# Altium project МЦТР.00010528.00.001.PrjPcb
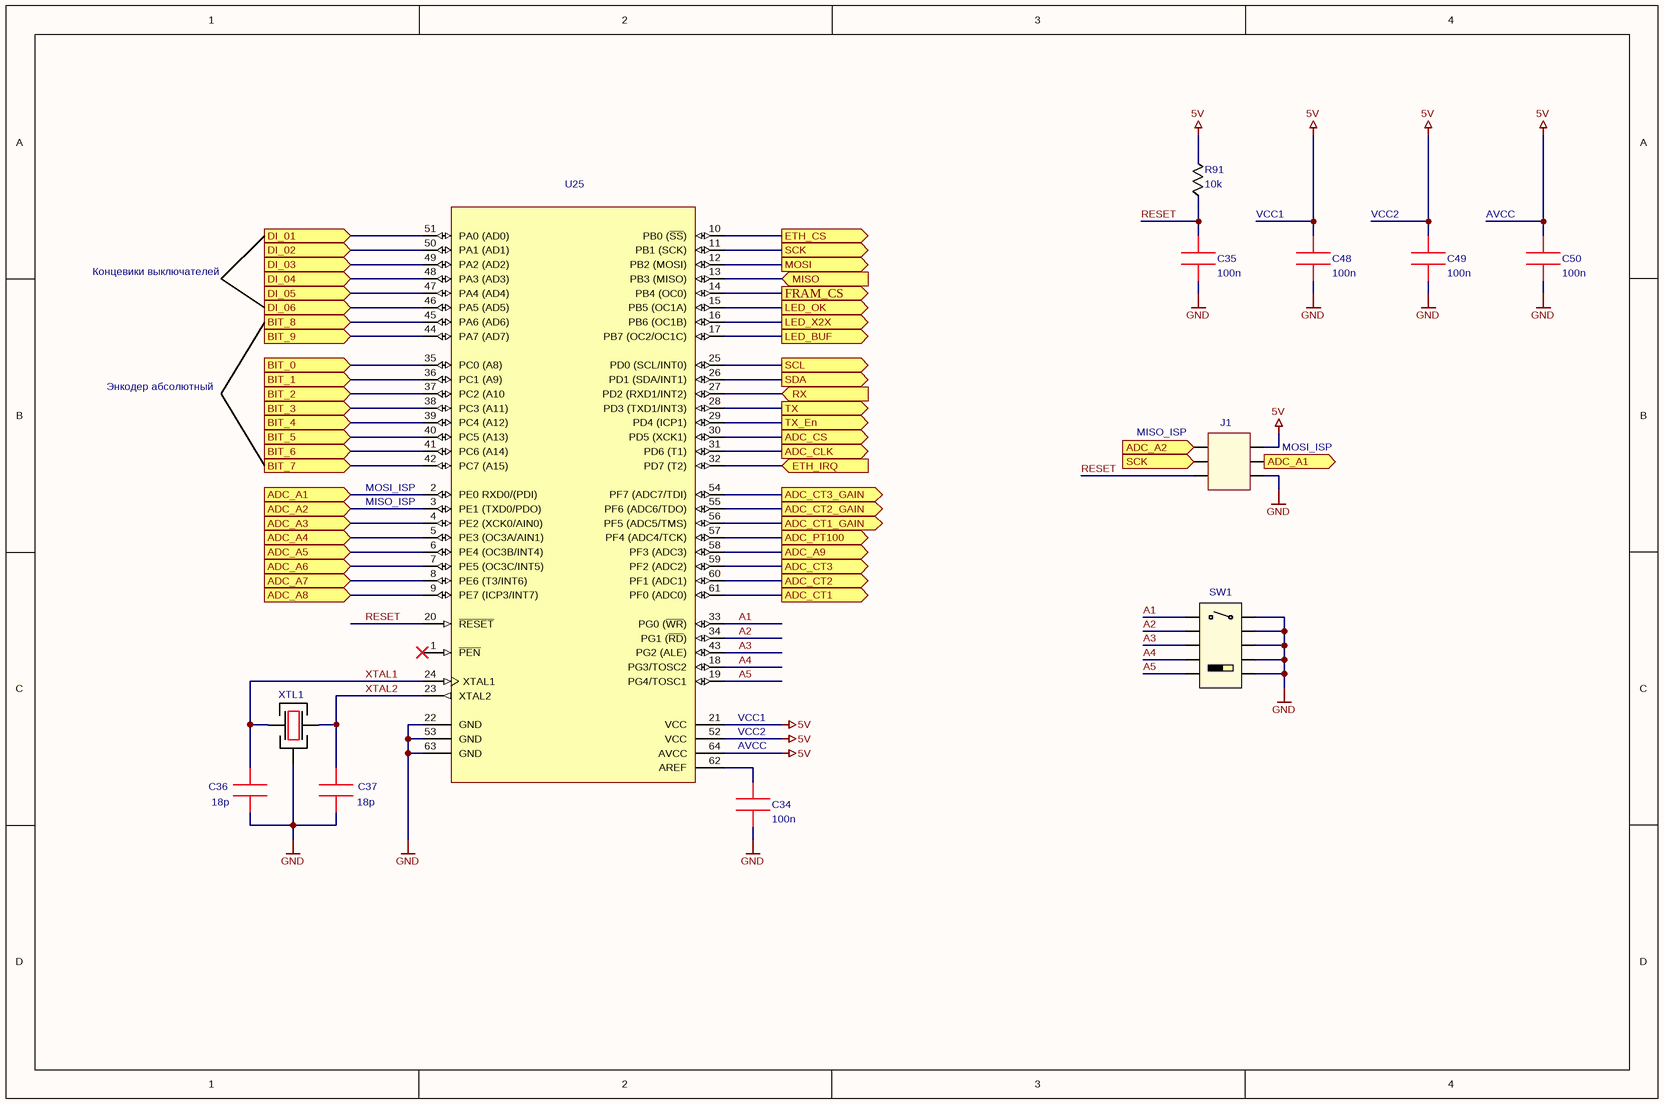
[diagram p0: MCU.SchDoc]
6 sheets, 163 parts. Net scope: global (net labels, ports and power ports of the same name join across sheets).
Board file: 讨倚.00010528.00.001.PcbDoc
Sheets:
  MCU.SchDoc
  RTC.SchDoc
  CT Main.SchDoc
  DI 220V DC.SchDoc
  PT100.SchDoc
  LEDs.SchDoc

## Sheet MCU.SchDoc
size A4

### Parts
C34  100n  [0603]
C35  100n  [0603]
C36  18p  [0603]
C37  18p  [0603]
C48  100n  [0603]
C49  100n  [0603]
C50  100n  [0603]
J1  Pin Line 2x3  [PLD-6 2.54]  (value not drawn)
R91  10k  [0603]
SW1  DIP-Switch 5 Pins  [Switch DIP-5]  (value not drawn)
U25  MCU  [64A_N]  (value not drawn)
XTL1  16.0 MHz  [ABM10]  (value not drawn)

### Ports
ADC_A1, ADC_A2, ADC_A3, ADC_A4, ADC_A5, ADC_A6, ADC_A7, ADC_A8, ADC_A9, ADC_CLK, ADC_CS, ADC_CT1, ADC_CT1_GAIN, ADC_CT2, ADC_CT2_GAIN, ADC_CT3, ADC_CT3_GAIN, ADC_PT100, BIT_0, BIT_1, BIT_2, BIT_3, BIT_4, BIT_5, BIT_6, BIT_7, BIT_8, BIT_9, DI_01, DI_02, DI_03, DI_04, DI_05, DI_06, ETH_CS, ETH_IRQ, FRAM_CS, LED_BUF, LED_OK, LED_X2X, MISO, MOSI, RX, SCK, SCL, SDA, TX, TX_En

### Nets
5V: C48.2 C49.2 C50.2 J1.2 R91.2 U25.21(VCC) U25.52(VCC) U25.64(AVCC)
GND: C34.1 C35.1 C36.1 C37.1 C48.1 C49.1 C50.1 J1.6 SW1.1 SW1.3 SW1.5 SW1.7 SW1.9 U25.22(GND) U25.53(GND) U25.63(GND) XTL1.2
A1: SW1.2 U25.33(PG0_(~{WR}))
A2: SW1.4 U25.34(PG1_(~{RD}))
A3: SW1.6 U25.43(PG2_(ALE))
A4: SW1.8 U25.18(PG3/TOSC2)
A5: SW1.10 U25.19(PG4/TOSC1)
ADC_A1: J1.4 U25.2(PE0_RXD0/(PDI)) ; port ADC_A1
ADC_A2: J1.1 U25.3(PE1_(TXD0/PDO)) ; port ADC_A2
ADC_A3: U25.4(PE2_(XCK0/AIN0)) ; port ADC_A3
ADC_A4: U25.5(PE3_(OC3A/AIN1)) ; port ADC_A4
ADC_A5: U25.6(PE4_(OC3B/INT4)) ; port ADC_A5
ADC_A6: U25.7(PE5_(OC3C/INT5)) ; port ADC_A6
ADC_A7: U25.8(PE6_(T3/INT6)) ; port ADC_A7
ADC_A8: U25.9(PE7_(ICP3/INT7)) ; port ADC_A8
ADC_A9: U25.58(PF3_(ADC3)) ; port ADC_A9
ADC_CLK: U25.31(PD6_(T1)) ; port ADC_CLK
ADC_CS: U25.30(PD5_(XCK1)) ; port ADC_CS
ADC_CT1: U25.61(PF0_(ADC0)) ; port ADC_CT1
ADC_CT1_GAIN: U25.56(PF5_(ADC5/TMS)) ; port ADC_CT1_GAIN
ADC_CT2: U25.60(PF1_(ADC1)) ; port ADC_CT2
ADC_CT2_GAIN: U25.55(PF6_(ADC6/TDO)) ; port ADC_CT2_GAIN
ADC_CT3: U25.59(PF2_(ADC2)) ; port ADC_CT3
ADC_CT3_GAIN: U25.54(PF7_(ADC7/TDI)) ; port ADC_CT3_GAIN
ADC_PT100: U25.57(PF4_(ADC4/TCK)) ; port ADC_PT100
BIT_0: U25.35(PC0_(A8)) ; port BIT_0
BIT_1: U25.36(PC1_(A9)) ; port BIT_1
BIT_2: U25.37(PC2_(A10) ; port BIT_2
BIT_3: U25.38(PC3_(A11)) ; port BIT_3
BIT_4: U25.39(PC4_(A12)) ; port BIT_4
BIT_5: U25.40(PC5_(A13)) ; port BIT_5
BIT_6: U25.41(PC6_(A14)) ; port BIT_6
BIT_7: U25.42(PC7_(A15)) ; port BIT_7
BIT_8: U25.45(PA6_(AD6)) ; port BIT_8
BIT_9: U25.44(PA7_(AD7)) ; port BIT_9
DI_01: U25.51(PA0_(AD0)) ; port DI_01
DI_02: U25.50(PA1_(AD1)) ; port DI_02
DI_03: U25.49(PA2_(AD2)) ; port DI_03
DI_04: U25.48(PA3_(AD3)) ; port DI_04
DI_05: U25.47(PA4_(AD4)) ; port DI_05
DI_06: U25.46(PA5_(AD5)) ; port DI_06
ETH_CS: U25.10(PB0_(~{SS})) ; port ETH_CS
ETH_IRQ: U25.32(PD7_(T2)) ; port ETH_IRQ
FRAM_CS: U25.14(PB4_(OC0)) ; port FRAM_CS
LED_BUF: U25.17(PB7_(OC2/OC1C)) ; port LED_BUF
LED_OK: U25.15(PB5_(OC1A)) ; port LED_OK
LED_X2X: U25.16(PB6_(OC1B)) ; port LED_X2X
MISO: U25.13(PB3_(MISO)) ; port MISO
MOSI: U25.12(PB2_(MOSI)) ; port MOSI
RESET: C35.2 J1.5 R91.1 U25.20(~{RESET})
RX: U25.27(PD2_(RXD1/INT2)) ; port RX
SCK: J1.3 U25.11(PB1_(SCK)) ; port SCK
SCL: U25.25(PD0_(SCL/INT0)) ; port SCL
SDA: U25.26(PD1_(SDA/INT1)) ; port SDA
TX: U25.28(PD3_(TXD1/INT3)) ; port TX
TX_En: U25.29(PD4_(ICP1)) ; port TX_En
XTAL1: C36.2 U25.24(XTAL1) XTL1.1
XTAL2: C37.2 U25.23(XTAL2) XTL1.3
NetC34_2: C34.2 U25.62(AREF)

Not connected (* = marked no-connect by the designer): U25 1(~{PEN})*

### Notes on the sheet
- VCC1
- VCC2
- AVCC
- Концевики выключателей
- Энкодер абсолютный
- (near J1) MISO_ISP
- (near J1) MOSI_ISP
- (near U25) MOSI_ISP
- (near U25) MISO_ISP
- (near U25) VCC1

### Library data of the parts
C34 C35 C48-C50 = 0603 CAP: CC0603KRX7R9BB104
C36 C37 = 0603 CAP: CC0603JRNPO9BN180
J1 = PLD-6
R91 = 0603 RES: RC0603FR-0710KL
SW1 = Switch DIP-5: DIP-Switch NDP-05
U25 = ATmega128A-AU: DatasheetVersion: revH, Feb-2011; PackageVersion: revC, Oct-2010; PackageReference: 64A; PackageDescription: 64-Pin Plastic Thin Profile Quad Flat Pack, 14 x 14 x 1.0 mm Body, 0.8 mm Pitch (TQFP); Code_JEDEC: MS-026-AEB; ComponentLink1Description: Manufacturer URL; ComponentLink1URL: http://www.atmel.com/; ComponentLink2Description: ATmega128A Datasheet; ComponentLink2URL: http://www.atmel.com/dyn/resources/prod_documents/doc8151.pdf; ComponentLink3Description: ATmega128A Summary; ComponentLink3URL: http://www.atmel.com/dyn/resources/prod_documents/8151S.pdf
XTL1 = KX-7: 12.88605

## Sheet RTC.SchDoc
size A4; PageSetup: Record=PageOptions|CenterHorizontal=True|CenterVertical=True|PrintScale=0.99|XCorrection=1.00|YCorrection=1.00|PrintKind=1|BorderSize=5000000|LeftOffset=0|BottomOffset=0|Orientation=1|PaperLength=1000|PaperWidth=1000|Scale=100|PaperSource=15|PrintQuality=600|MediaType=1|DitherType=10|PrintScaleMode=1|PaperKind=A4|PaperIndex=9
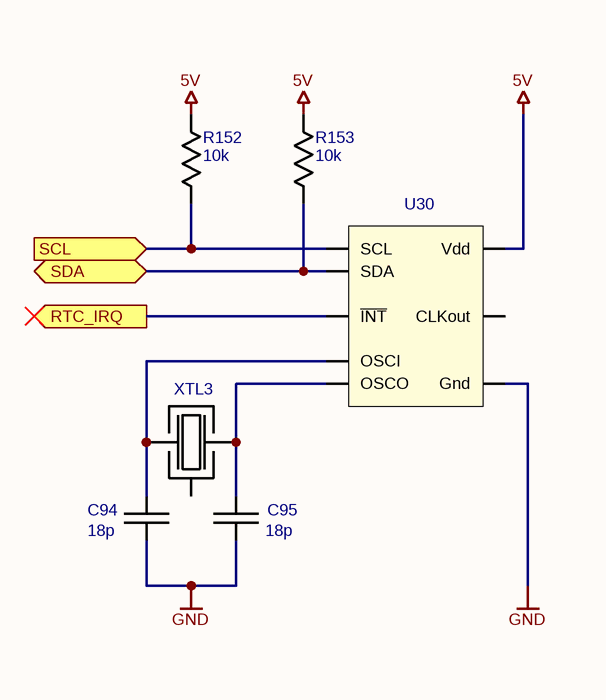
[diagram p1: RTC.SchDoc]

### Parts
C94  18p  [CAP CER 0603 NP]
C95  18p  [CAP CER 0603 NP]
R152  10k  [RES 0603]
R153  10k  [RES 0603]
U30  Real-Time Clock IC  [SOIC-8]  (value not drawn)
XTL3  32.768 kHz  [XTAL KX-327NHT]  (value not drawn)

### Ports
RTC_IRQ, SCL, SDA

### Nets
5V: R152.2 R153.2 U30.8(Vdd)
GND: C94.1 C95.1 U30.4(Gnd)
RTC_IRQ: U30.3(~{INT}) ; port RTC_IRQ
SCL: R152.1 U30.6(SCL) ; port SCL
SDA: R153.1 U30.5(SDA) ; port SDA
NetC94_2: C94.2 U30.1(OSCI) XTL3.1
NetC95_2: C95.2 U30.2(OSCO) XTL3.3

Not connected (* = marked no-connect by the designer): U30 7(CLKout); XTL3 2

### Library data of the parts
C94 C95 = Capacitor: CC0603JRNPO9BN180
R152 R153 = Resistor: RC0603FR-0710KL
U30 = PCF8653: PCF8563T/5,518
XTL3 = Quartz Resonator: 12.87150

## Sheet CT Main.SchDoc
size A3
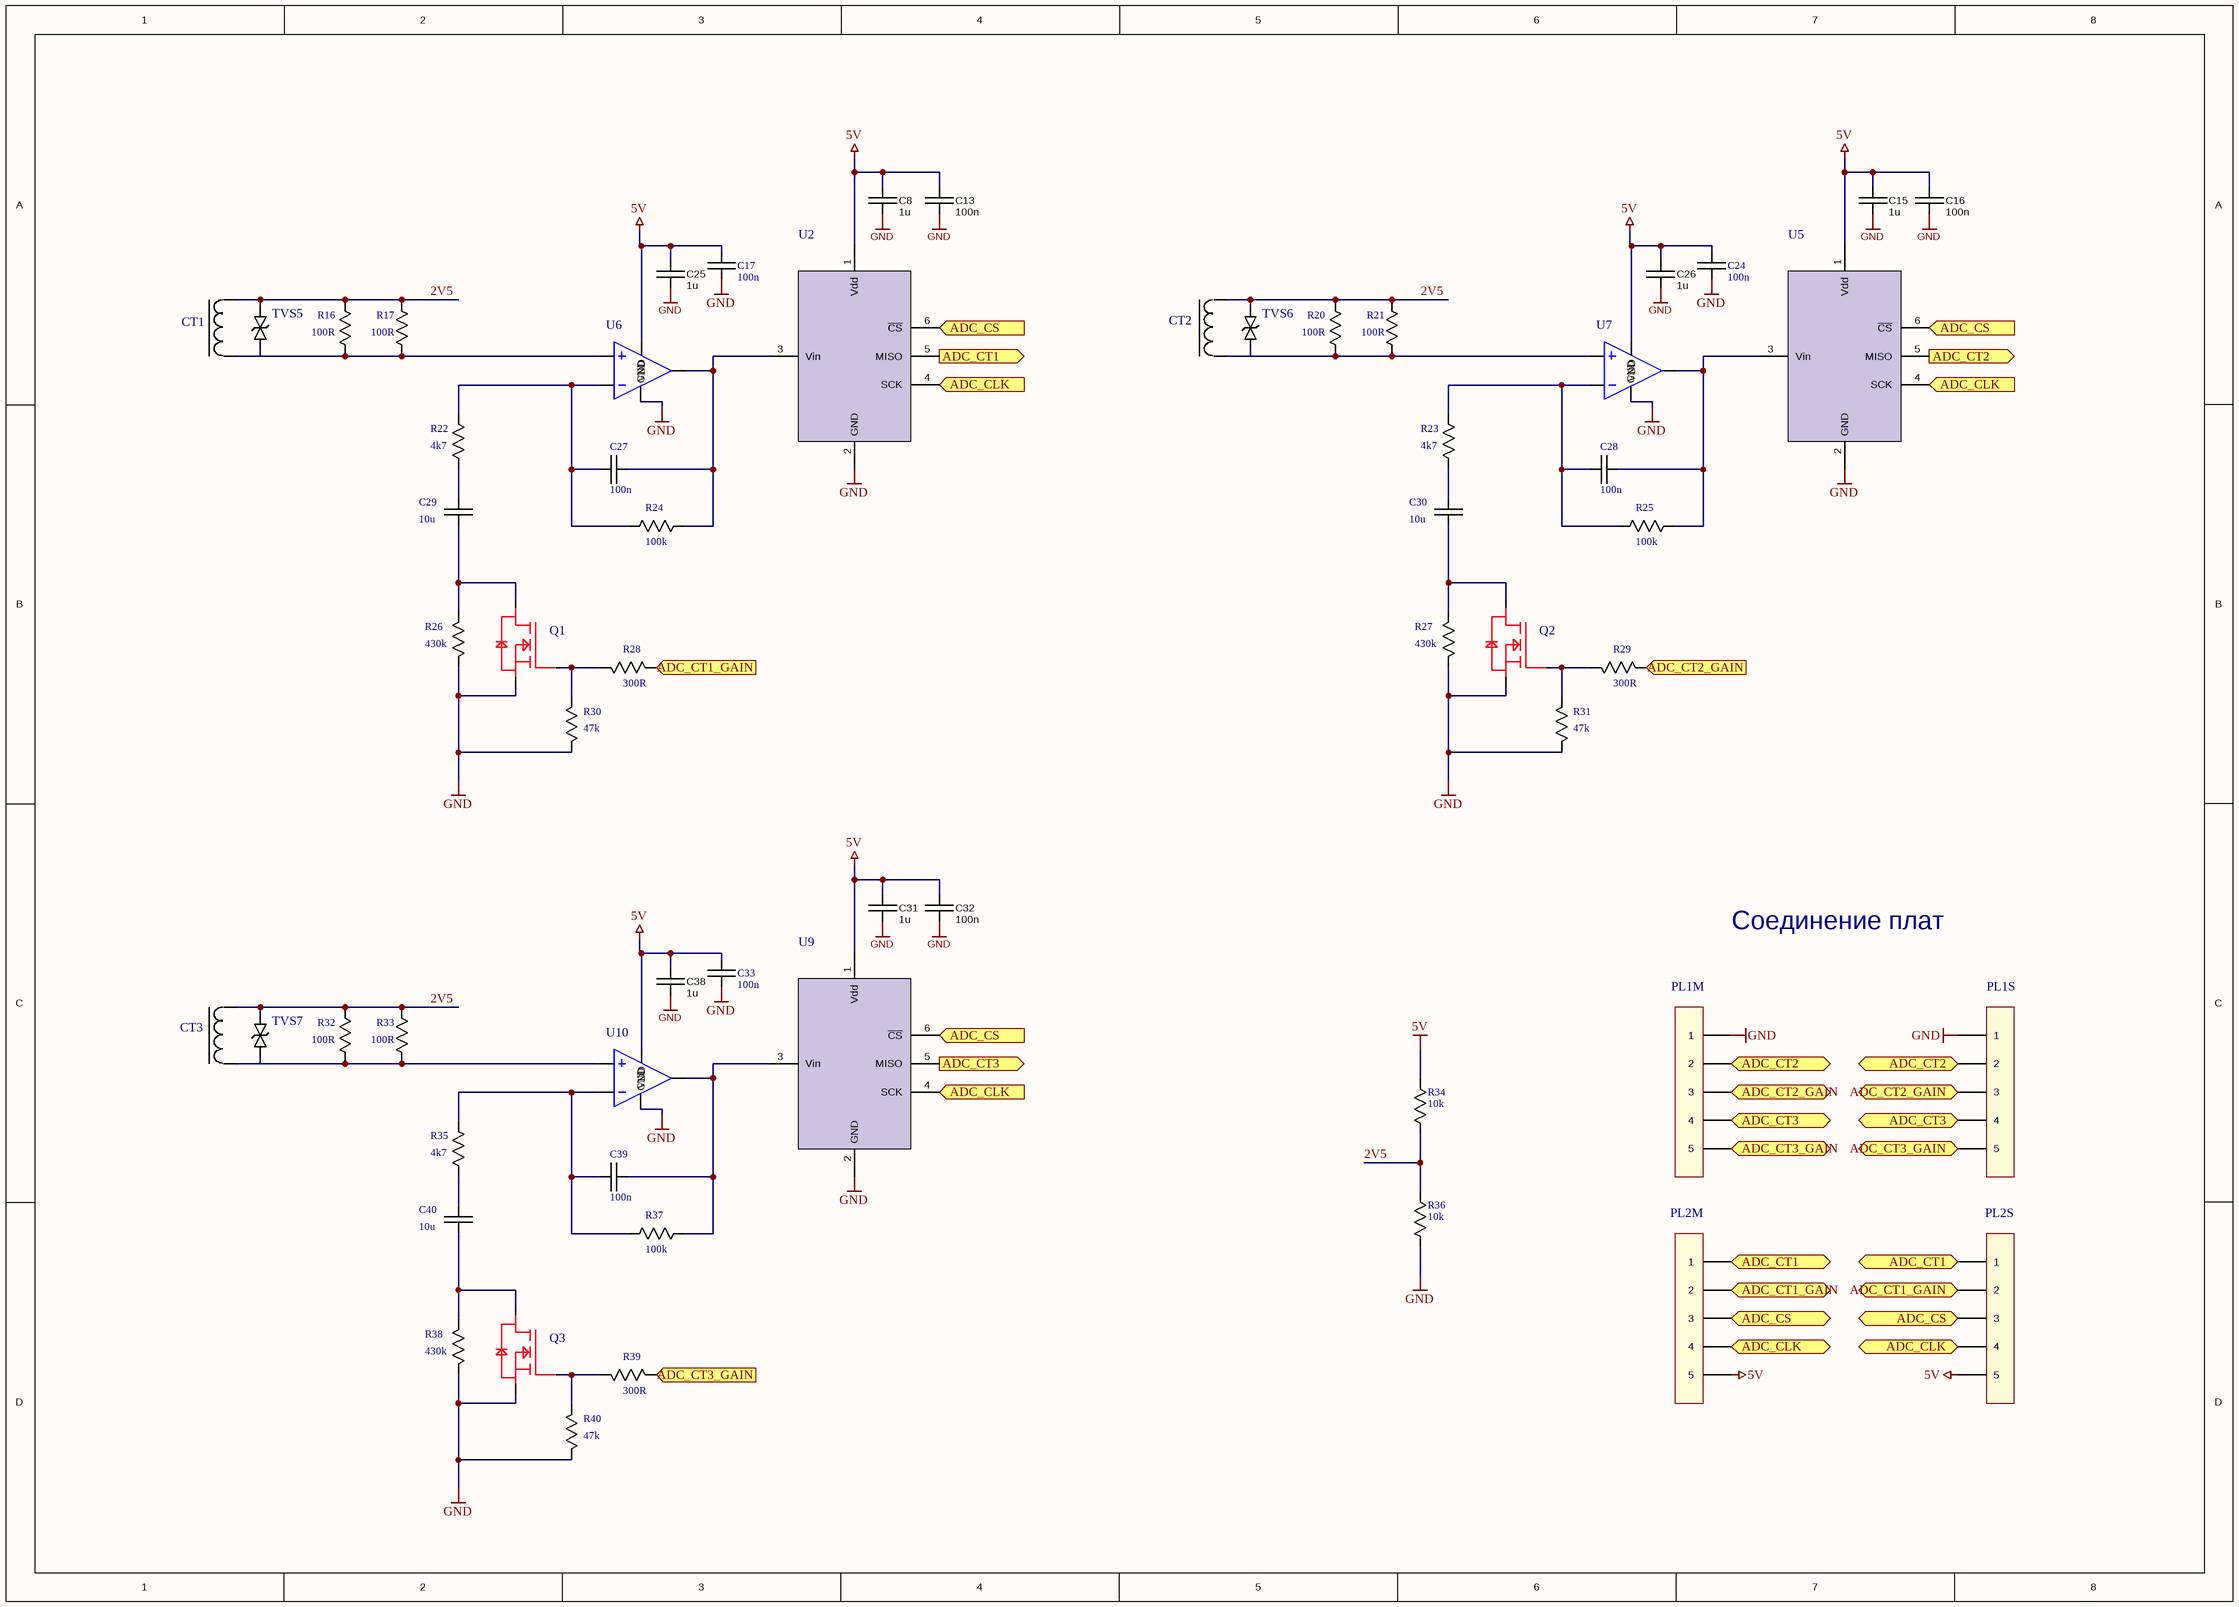
[diagram p2: CT Main.SchDoc]

### Parts
C8  1u  [CAP CER 0603 NP]
C13  100n  [CAP CER 0603 NP]
C15  1u  [CAP CER 0603 NP]
C16  100n  [CAP CER 0603 NP]
C17  100n  [0603]
C24  100n  [0603]
C25  1u  [CAP CER 0603 NP]
C26  1u  [CAP CER 0603 NP]
C27  100n  [0603]
C28  100n  [0603]
C29  10u  [0603]
C30  10u  [0603]
C31  1u  [CAP CER 0603 NP]
C32  100n  [CAP CER 0603 NP]
C33  100n  [0603]
C38  1u  [CAP CER 0603 NP]
C39  100n  [0603]
C40  10u  [0603]
CT1  Current Transformer  [Talema AC1005]  (value not drawn)
CT2  Current Transformer  [Talema AC1005]  (value not drawn)
CT3  Current Transformer  [Talema AC1005]  (value not drawn)
PL1M  Pin Line  [PLS-5 2.54]  (value not drawn)  (no BOM)
PL1S  Pin Line  [PLS-5 2.54 - Part]  (value not drawn)
PL2M  Pin Line  [PLS-5 2.54]  (value not drawn)  (no BOM)
PL2S  Pin Line  [PLS-5 2.54 - Part]  (value not drawn)
Q1  MOSFET-N  [SOT23]  (value not drawn)
Q2  MOSFET-N  [SOT23]  (value not drawn)
Q3  MOSFET-N  [SOT23]  (value not drawn)
R16  100R  [1206]
R17  100R  [1206]
R20  100R  [1206]
R21  100R  [1206]
R22  4k7  [0603]
R23  4k7  [0603]
R24  100k  [0603]
R25  100k  [0603]
R26  430k  [0603]
R27  430k  [0603]
R28  300R  [0603]
R29  300R  [0603]
R30  47k  [0603]
R31  47k  [0603]
R32  100R  [1206]
R33  100R  [1206]
R34  10k  [0603]
R35  4k7  [0603]
R36  10k  [0603]
R37  100k  [0603]
R38  430k  [0603]
R39  300R  [0603]
R40  47k  [0603]
TVS5  TVS 5V  [DO-214AC]  (value not drawn)
TVS6  TVS 5V  [DO-214AC]  (value not drawn)
TVS7  TVS 5V  [DO-214AC]  (value not drawn)
U2  SAR ADC  [SOT23 - 6]  (value not drawn)
U5  SAR ADC  [SOT23 - 6]  (value not drawn)
U6  TS321ILT  [SOT235]  (value not drawn)
U7  TS321ILT  [SOT235]  (value not drawn)
U9  SAR ADC  [SOT23 - 6]  (value not drawn)
U10  TS321ILT  [SOT235]  (value not drawn)

### Ports
ADC_CLK, ADC_CS, ADC_CT1, ADC_CT1_GAIN, ADC_CT2, ADC_CT2_GAIN, ADC_CT3, ADC_CT3_GAIN

### Nets
5V: C8.1 C13.2 C15.1 C16.2 C17.2 C24.2 C25.1 C26.1 C31.1 C32.2 C33.2 C38.1 PL2M.5 PL2S.5 R34.1 U2.1(Vdd) U5.1(Vdd) U6.5(VDD) U7.5(VDD) U9.1(Vdd) U10.5(VDD)
GND: C8.2 C13.1 C15.2 C16.1 C17.1 C24.1 C25.2 C26.2 C31.2 C32.1 C33.1 C38.2 PL1M.1 PL1S.1 Q1.2 Q2.2 Q3.2 R26.1 R27.1 R30.1 R31.1 R36.2 R38.1 R40.1 U2.2(GND) U5.2(GND) U6.2(GND) U7.2(GND) U9.2(GND) U10.2(GND)
2V5: CT1.2 CT2.2 CT3.2 R16.2 R17.2 R20.2 R21.2 R32.2 R33.2 R34.2 R36.1 TVS5.2 TVS6.2 TVS7.2
ADC_CLK: PL2M.4 PL2S.4 U2.4(SCK) U5.4(SCK) U9.4(SCK) ; port ADC_CLK
ADC_CS: PL2M.3 PL2S.3 U2.6(~{CS}) U5.6(~{CS}) U9.6(~{CS}) ; port ADC_CS
ADC_CT1: PL2M.1 PL2S.1 U2.5(MISO) ; port ADC_CT1
ADC_CT1_GAIN: PL2M.2 PL2S.2 R28.1 ; port ADC_CT1_GAIN
ADC_CT2: PL1M.2 PL1S.2 U5.5(MISO) ; port ADC_CT2
ADC_CT2_GAIN: PL1M.3 PL1S.3 R29.1 ; port ADC_CT2_GAIN
ADC_CT3: PL1M.4 PL1S.4 U9.5(MISO) ; port ADC_CT3
ADC_CT3_GAIN: PL1M.5 PL1S.5 R39.1 ; port ADC_CT3_GAIN
NetC27_1: C27.1 R22.2 R24.1 U6.4(-IN)
NetC27_2: C27.2 R24.2 U2.3(Vin) U6.1(OUT)
NetC28_1: C28.1 R23.2 R25.1 U7.4(-IN)
NetC28_2: C28.2 R25.2 U5.3(Vin) U7.1(OUT)
NetC29_1: C29.1 Q1.3 R26.2
NetC29_2: C29.2 R22.1
NetC30_1: C30.1 Q2.3 R27.2
NetC30_2: C30.2 R23.1
NetC39_1: C39.1 R35.2 R37.1 U10.4(-IN)
NetC39_2: C39.2 R37.2 U9.3(Vin) U10.1(OUT)
NetC40_1: C40.1 Q3.3 R38.2
NetC40_2: C40.2 R35.1
NetCT1_1: CT1.1 R16.1 R17.1 TVS5.1 U6.3(+IN)
NetCT2_1: CT2.1 R20.1 R21.1 TVS6.1 U7.3(+IN)
NetCT3_1: CT3.1 R32.1 R33.1 TVS7.1 U10.3(+IN)
NetQ1_1: Q1.1 R28.2 R30.2
NetQ2_1: Q2.1 R29.2 R31.2
NetQ3_1: Q3.1 R39.2 R40.2

### Notes on the sheet
- Соединение плат

### Library data of the parts
C8 C15 C25 C26 C31 C38 = Capacitor: CC0603KRX5R7BB105
C13 C16 C17 C24 C27 C28 C32 C33 C39 = Capacitor: CC0603KRX7R9BB104
C29 C30 C40 = Capacitor: GRM188R61C106MA73D
CT1-CT3 = Current Trans: AC-1005
PL1M PL1S PL2M PL2S = PLS-5: PLS-5 2.54
Q1-Q3 = IRLML: IRLML2502TR
R16 R17 R20 R21 R32 R33 = Resistor: RT1206BRD07100RL
R22 R23 R35 = Resistor: RC0603FR-074K7L
R24 R25 R37 = Resistor: RC0603FR-07100KL
R26 R27 R38 = Resistor: RC0603FR-07430KL
R28 R29 R39 = Resistor: RC0603FR-07300RL
R30 R31 R40 = Resistor: RC0603FR-0747KL
R34 R36 = Resistor: RC0603FR-0710KL
TVS5-TVS7 = SMAJ5.0CA
U2 U5 U9 = ADC121: ADC121S021CIMF
U6 U7 U10 = OPAMP

## Sheet DI 220V DC.SchDoc
size A4
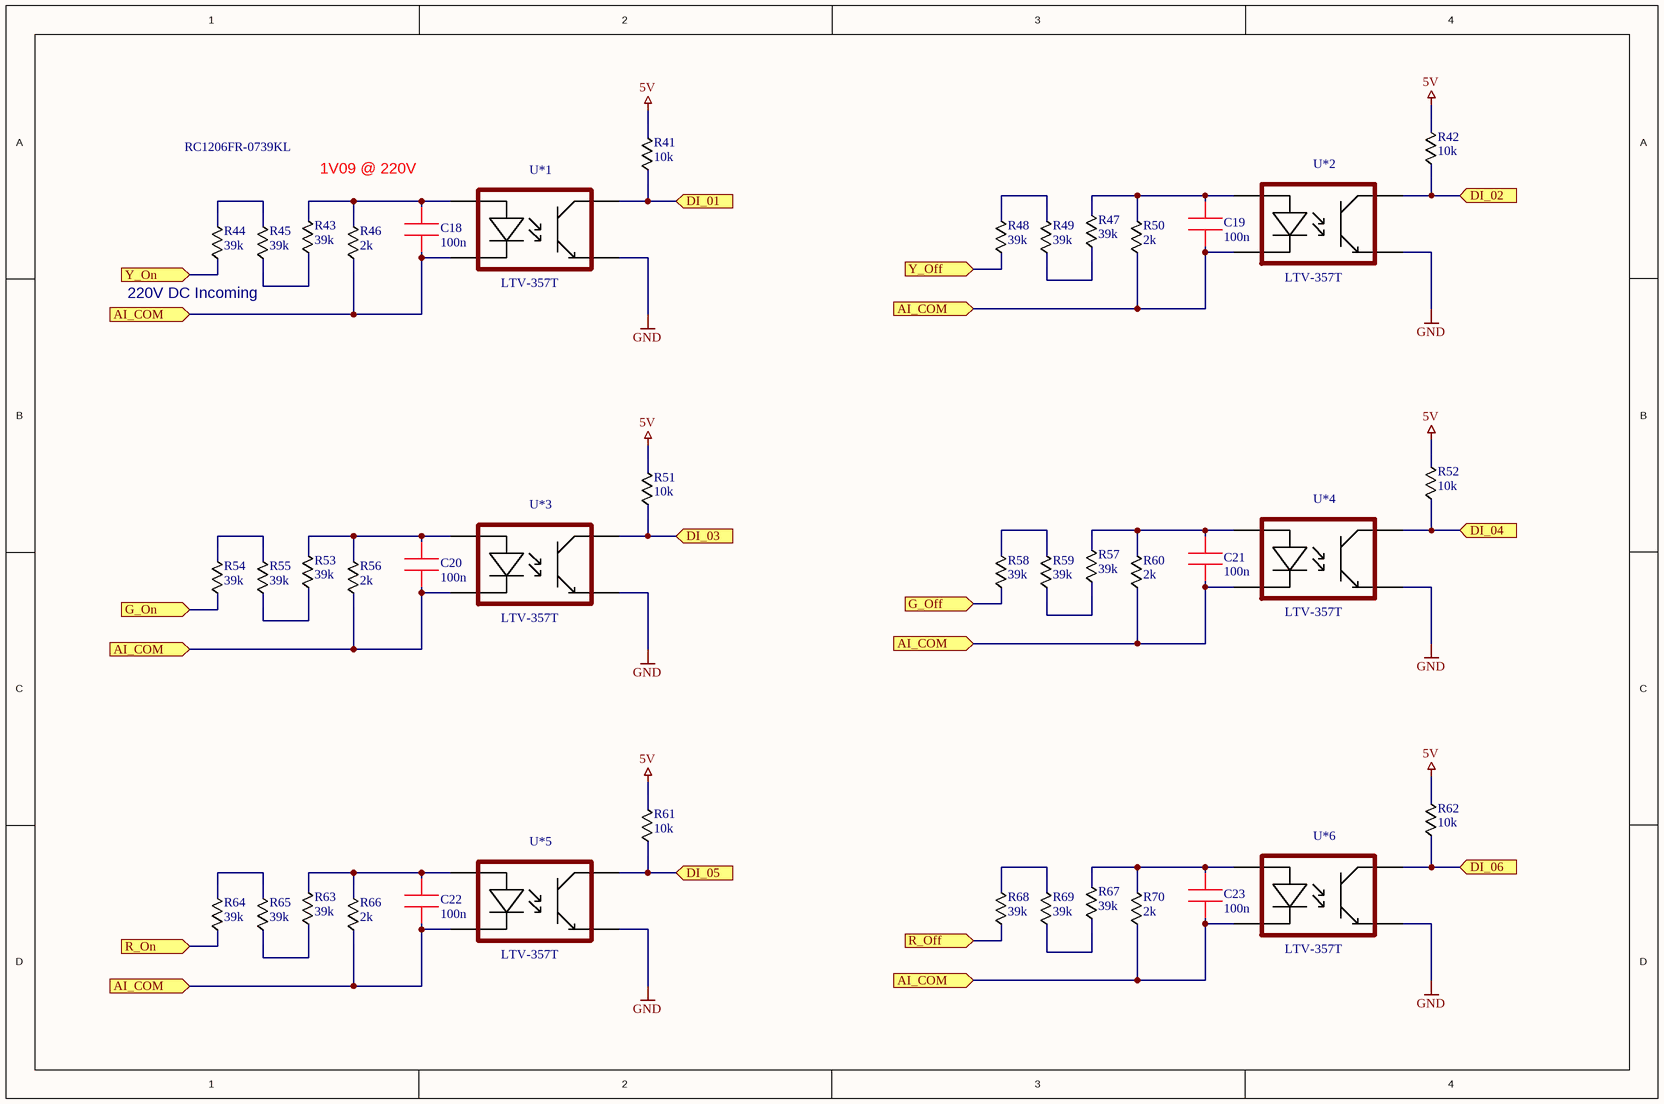
[diagram p3: DI 220V DC.SchDoc]

### Parts
C18  100n  [0603]
C19  100n  [0603]
C20  100n  [0603]
C21  100n  [0603]
C22  100n  [0603]
C23  100n  [0603]
R41  10k  [0603]
R42  10k  [0603]
R43  39k  [1206]
R44  39k  [1206]
R45  39k  [1206]
R46  2k  [1206]
R47  39k  [1206]
R48  39k  [1206]
R49  39k  [1206]
R50  2k  [1206]
R51  10k  [0603]
R52  10k  [0603]
R53  39k  [1206]
R54  39k  [1206]
R55  39k  [1206]
R56  2k  [1206]
R57  39k  [1206]
R58  39k  [1206]
R59  39k  [1206]
R60  2k  [1206]
R61  10k  [0603]
R62  10k  [0603]
R63  39k  [1206]
R64  39k  [1206]
R65  39k  [1206]
R66  2k  [1206]
R67  39k  [1206]
R68  39k  [1206]
R69  39k  [1206]
R70  2k  [1206]
U*1  LTV-357T  [SOP-4]
U*2  LTV-357T  [SOP-4]
U*3  LTV-357T  [SOP-4]
U*4  LTV-357T  [SOP-4]
U*5  LTV-357T  [SOP-4]
U*6  LTV-357T  [SOP-4]

### Ports
AI_COM, DI_01, DI_02, DI_03, DI_04, DI_05, DI_06, G_Off, G_On, R_Off, R_On, Y_Off, Y_On

### Nets
5V: R41.2 R42.2 R51.2 R52.2 R61.2 R62.2
GND: U*1.Emmiter(E) U*2.Emmiter(E) U*3.Emmiter(E) U*4.Emmiter(E) U*5.Emmiter(E) U*6.Emmiter(E)
AI_COM: C18.1 C19.1 C20.1 C21.1 C22.1 C23.1 R46.1 R50.1 R56.1 R60.1 R66.1 R70.1 U*1.Cathode(C) U*2.Cathode(C) U*3.Cathode(C) U*4.Cathode(C) U*5.Cathode(C) U*6.Cathode(C) ; port AI_COM
DI_01: R41.1 U*1.Collector(C) ; port DI_01
DI_02: R42.1 U*2.Collector(C) ; port DI_02
DI_03: R51.1 U*3.Collector(C) ; port DI_03
DI_04: R52.1 U*4.Collector(C) ; port DI_04
DI_05: R61.1 U*5.Collector(C) ; port DI_05
DI_06: R62.1 U*6.Collector(C) ; port DI_06
G_Off: R58.1 ; port G_Off
G_On: R54.1 ; port G_On
R_Off: R68.1 ; port R_Off
R_On: R64.1 ; port R_On
Y_Off: R48.1 ; port Y_Off
Y_On: R44.1 ; port Y_On
NetC18_2: C18.2 R43.2 R46.2 U*1.Anode(A)
NetC19_2: C19.2 R47.2 R50.2 U*2.Anode(A)
NetC20_2: C20.2 R53.2 R56.2 U*3.Anode(A)
NetC21_2: C21.2 R57.2 R60.2 U*4.Anode(A)
NetC22_2: C22.2 R63.2 R66.2 U*5.Anode(A)
NetC23_2: C23.2 R67.2 R70.2 U*6.Anode(A)
NetR43_1: R43.1 R45.1
NetR44_2: R44.2 R45.2
NetR47_1: R47.1 R49.1
NetR48_2: R48.2 R49.2
NetR53_1: R53.1 R55.1
NetR54_2: R54.2 R55.2
NetR57_1: R57.1 R59.1
NetR58_2: R58.2 R59.2
NetR63_1: R63.1 R65.1
NetR64_2: R64.2 R65.2
NetR67_1: R67.1 R69.1
NetR68_2: R68.2 R69.2

### Notes on the sheet
- RC1206FR-0739KL
- 1V09 @ 220V
- 220V DC Incoming

### Library data of the parts
C18-C23 = 0603 CAP: CC0603KRX7R9BB104
R41 R42 R51 R52 R61 R62 = 0603 RES: RC0603FR-0710KL
R43-R45 R47-R49 R53-R55 R57-R59 R63-R65 R67-R69 = 1206 R: RC1206FR-0739KL
R46 R50 R56 R60 R66 R70 = 1206 R: RC1206FR-072KL
U*1-U*6 = LTV-357T: pin to pad: Anode>1 Cathode>2 Collector>4 Emmiter>3

## Sheet PT100.SchDoc
size A4; PageSetup: Record=PageOptions|CenterHorizontal=True|CenterVertical=True|PrintScale=0.99|XCorrection=1.00|YCorrection=1.00|PrintKind=1|BorderSize=5000000|LeftOffset=0|BottomOffset=0|Orientation=1|PaperLength=1000|PaperWidth=1000|Scale=100|PaperSource=15|PrintQuality=600|MediaType=1|DitherType=10|PrintScaleMode=1|PaperKind=A4|PaperIndex=9
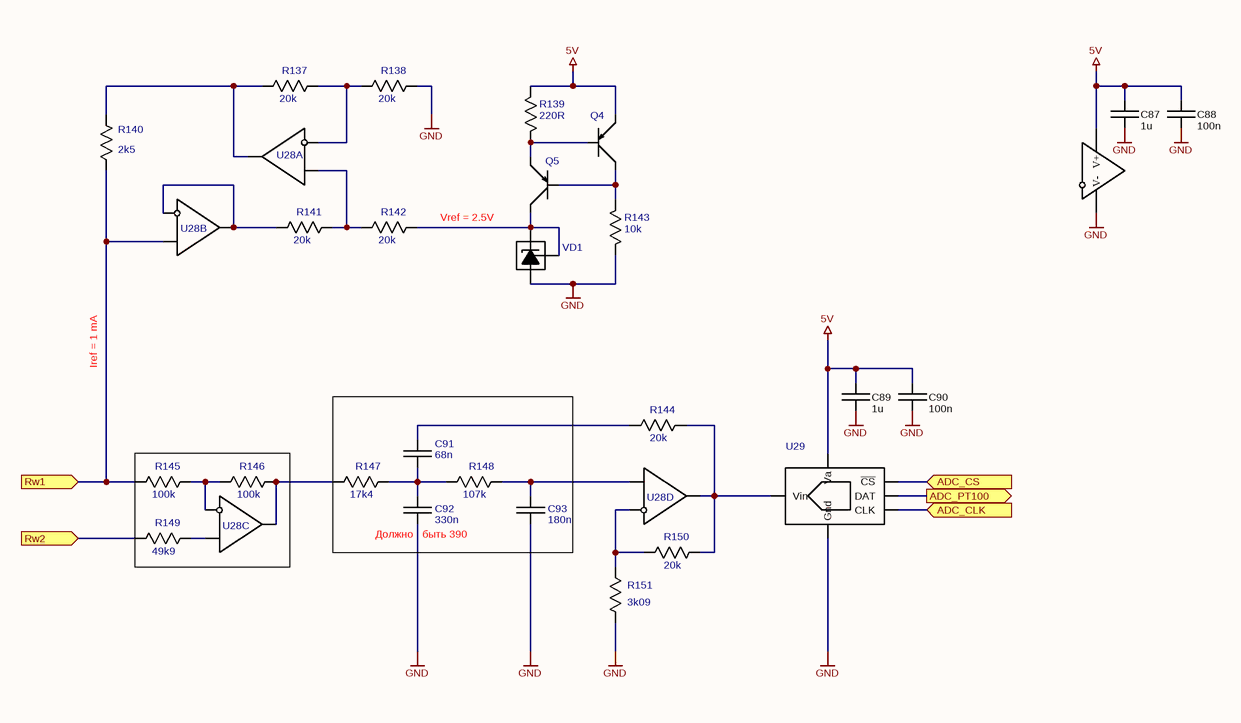
[diagram p4: PT100.SchDoc]

### Parts
C87  1u  [CAP CER 0603 NP]
C88  100n  [CAP CER 0603 NP]
C89  1u  [CAP CER 0603 NP]
C90  100n  [CAP CER 0603 NP]
C91  68n  [CAP CER 0603 NP]
C92  330n  [CAP CER 0603 NP]
C93  180n  [CAP CER 0603 NP]
Q4  PNP Bipolar Transistor  [SOT-23]  (value not drawn)
Q5  PNP Bipolar Transistor  [SOT-23]  (value not drawn)
R137  20k  [RES 0603]
R138  20k  [RES 0603]
R139  220R  [RES 0603]
R140  2k5  [RES 0603]
R141  20k  [RES 0603]
R142  20k  [RES 0603]
R143  10k  [RES 0603]
R144  20k  [RES 0603]
R145  100k  [RES 0603]
R146  100k  [RES 0603]
R147  17k4  [RES 0603]
R148  107k  [RES 0603]
R149  49k9  [RES 0603]
R150  20k  [RES 0603]
R151  3k09  [RES 0603]
U28  OpAmp x4 Small  (value not drawn)  (parts A,B,C,D,E of 5)
U29  SAR ADC  [SOT-23-6]  (value not drawn)
VD1  Zenner Diode Adjustable  [SOT-23]  (value not drawn)

### Blocks framed on the sheet
Должно   быть 390: C91-C93 R147 R148

### Ports
ADC_CLK, ADC_CS, ADC_PT100, Rw1, Rw2

### Nets
5V: C87.1 C88.1 C89.1 C90.1 Q4.2(E) R139.2 U28.13(V+) U29.1(Va)
GND: C87.2 C88.2 C89.2 C90.2 C92.1 C93.1 R138.2 R143.1 R151.1 U28.14(V-) U29.2(Gnd) VD1.1(A)
ADC_CLK: U29.4(CLK) ; port ADC_CLK
ADC_CS: U29.6(~{CS}) ; port ADC_CS
ADC_PT100: U29.5(DAT) ; port ADC_PT100
Rw1: R140.1 R145.1 U28.4(+IN) ; port Rw1
Rw2: R149.1 ; port Rw2
NetC91_1: C91.1 C92.2 R147.2 R148.1
NetC91_2: C91.2 R144.1
NetC93_2: C93.2 R148.2 U28.10(+IN)
NetQ4_1: Q4.1(B) Q5.2(E) R139.1
NetQ4_3: Q4.3(C) Q5.1(B) R143.2
NetQ5_3: Q5.3(C) R142.2 VD1.2(C) VD1.3(Ref)
NetR137_1: R137.1 R140.2 U28.3(OUT1)
NetR137_2: R137.2 R138.1 U28.2(-IN1)
NetR141_1: R141.1 U28.5(-IN) U28.6(OUT)
NetR141_2: R141.2 R142.1 U28.1(+IN1)
NetR144_2: R144.2 R150.2 U28.12(OUT) U29.3(Vin)
NetR145_2: R145.2 R146.1 U28.8(-IN)
NetR146_2: R146.2 R147.1 U28.9(OUT)
NetR149_2: R149.2 U28.7(+IN)
NetR150_1: R150.1 R151.2 U28.11(-IN)

### Notes on the sheet
- Vref = 2.5V
- Iref = 1 mA

### Library data of the parts
C87 C89 = Capacitor: CC0603KRX5R7BB105
C88 C90 = Capacitor: CC0603KRX7R9BB104
C91 = Capacitor: CC0603JRX7R9BB683
C92 = Capacitor: CC0603KRX5R8BB334
C93 = Capacitor: GRM188R71E184KA88D
Q4 Q5 = Bipolar PNP: BC857
R137 R138 R141 R142 = Resistor: RT0603BRD0720KL
R139 = Resistor: RT0603BRD07220RL
R140 = Resistor: AR03BTC2501
R143 = Resistor: RT0603BRD0710KL
R144 R150 = Resistor: RC0603FR-0720KL
R145 R146 = Resistor: RC0603FR-07100KL
R147 = Resistor: RC0603FR-0717K4L
R148 = Resistor: RC0603FR-07107KL
R149 = Resistor: RC0603FR-0749K9L
R151 = Resistor: RC0603FR-073K09L
U28 = OpAmp x4 Small: LMV324IDT
U29 = ADC121: ADC121S021CIMF
VD1 = TL431: TL431ACDBZR; pin to pad: 1>3 2>1 3>2

## Sheet LEDs.SchDoc
size A4
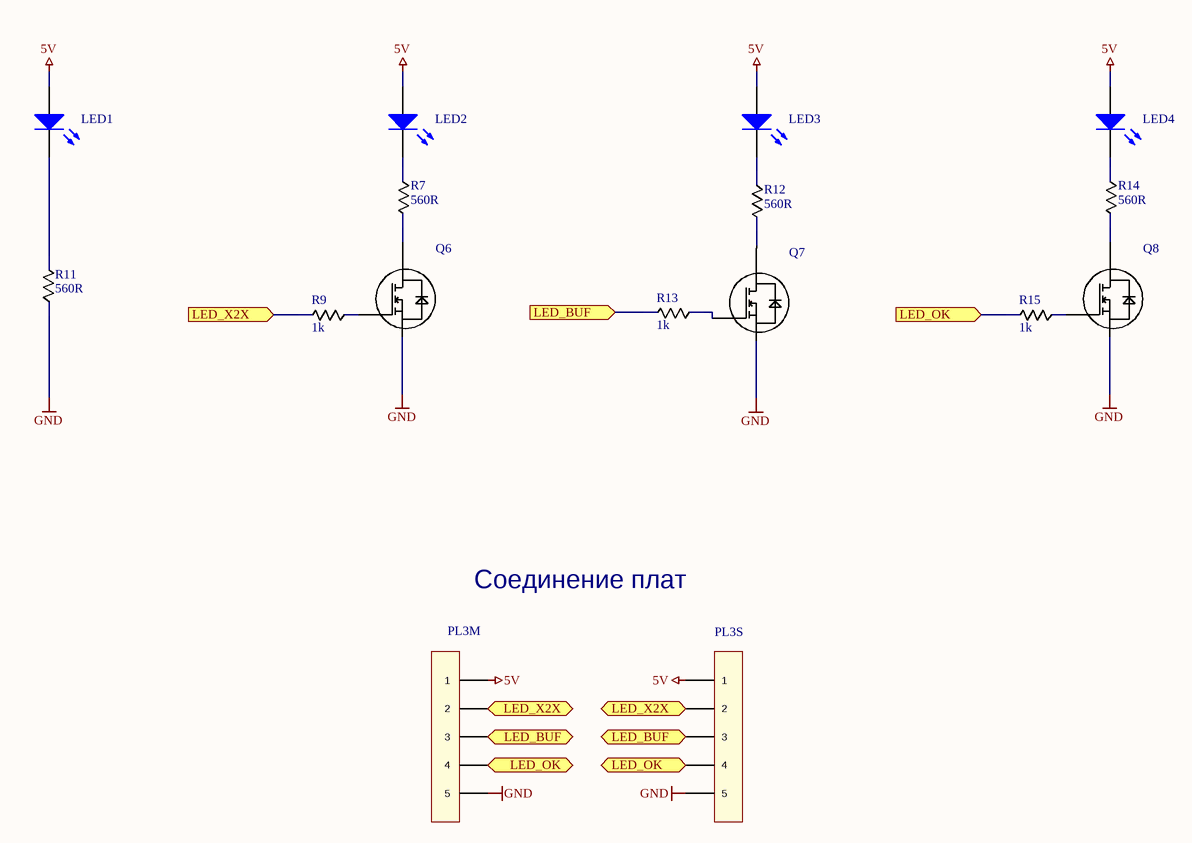
[diagram p5: LEDs.SchDoc]

### Parts
LED1  LED Green  [0603]  (value not drawn)
LED2  LED Green  [0603]  (value not drawn)
LED3  LED Green  [0603]  (value not drawn)
LED4  LED Green  [0603]  (value not drawn)
PL3M  Pin Line  [PLS-5 2.54]  (value not drawn)  (no BOM)
PL3S  Pin Line  [PLS-5 2.54 - Part]  (value not drawn)
Q6  MOSFET-N  [SOT23]  (value not drawn)
Q7  MOSFET-N  [SOT23]  (value not drawn)
Q8  MOSFET-N  [SOT23]  (value not drawn)
R7  560R  [0603]
R9  1k  [0603]
R11  560R  [0603]
R12  560R  [0603]
R13  1k  [0603]
R14  560R  [0603]
R15  1k  [0603]

### Ports
LED_BUF, LED_OK, LED_X2X

### Nets
5V: LED1.1(A) LED2.1(A) LED3.1(A) LED4.1(A) PL3M.1 PL3S.1
GND: PL3M.5 PL3S.5 Q6.2(S) Q7.2(S) Q8.2(S) R11.1
LED_BUF: PL3M.3 PL3S.3 R13.2 ; port LED_BUF
LED_OK: PL3M.4 PL3S.4 R15.2 ; port LED_OK
LED_X2X: PL3M.2 PL3S.2 R9.2 ; port LED_X2X
NetLED1_2: LED1.2(K) R11.2
NetLED2_2: LED2.2(K) R7.1
NetLED3_2: LED3.2(K) R12.1
NetLED4_2: LED4.2(K) R14.1
NetQ6_1: Q6.1(G) R9.1
NetQ6_3: Q6.3(D) R7.2
NetQ7_1: Q7.1(G) R13.1
NetQ7_3: Q7.3(D) R12.2
NetQ8_1: Q8.1(G) R15.1
NetQ8_3: Q8.3(D) R14.2

### Notes on the sheet
- Соединение плат

### Library data of the parts
LED1-LED4 = 0603 LED: KP-1608SGC; Published: 8-Jun-2000; LatestRevisionDate: 08-Jul-2005; LatestRevisionNote: Mech Layer 1 removed.; PackageReference: LED-0; Publisher: Altium Limited; PackageDescription: LED; 2 Leads
PL3M PL3S = PLS-5: PLS-5 2.54
Q6-Q8 = BSS138: IRLML2502TR
R7 R11 R12 R14 = 0603 RES: RC0603JR-07560RL
R9 R13 R15 = 0603 RES: RC0603FR-071KL

## Nets that join several sheets
5V: MCU (8 pins), RTC (R152.2 R153.2 U30.8), CT Main (21 pins), DI 220V DC (6 pins), PT100 (8 pins), LEDs (6 pins)
GND: MCU (17 pins), RTC (C94.1 C95.1 U30.4), CT Main (30 pins), DI 220V DC (6 pins), PT100 (12 pins), LEDs (6 pins)
ADC_CLK: MCU (U25.31), CT Main (5 pins), PT100 (U29.4)
ADC_CS: MCU (U25.30), CT Main (5 pins), PT100 (U29.6)
ADC_CT1: MCU (U25.61), CT Main (PL2M.1 PL2S.1 U2.5)
ADC_CT1_GAIN: MCU (U25.56), CT Main (PL2M.2 PL2S.2 R28.1)
ADC_CT2: MCU (U25.60), CT Main (PL1M.2 PL1S.2 U5.5)
ADC_CT2_GAIN: MCU (U25.55), CT Main (PL1M.3 PL1S.3 R29.1)
ADC_CT3: MCU (U25.59), CT Main (PL1M.4 PL1S.4 U9.5)
ADC_CT3_GAIN: MCU (U25.54), CT Main (PL1M.5 PL1S.5 R39.1)
ADC_PT100: MCU (U25.57), PT100 (U29.5)
DI_01: MCU (U25.51), DI 220V DC (R41.1 U*1.Collector)
DI_02: MCU (U25.50), DI 220V DC (R42.1 U*2.Collector)
DI_03: MCU (U25.49), DI 220V DC (R51.1 U*3.Collector)
DI_04: MCU (U25.48), DI 220V DC (R52.1 U*4.Collector)
DI_05: MCU (U25.47), DI 220V DC (R61.1 U*5.Collector)
DI_06: MCU (U25.46), DI 220V DC (R62.1 U*6.Collector)
LED_BUF: MCU (U25.17), LEDs (PL3M.3 PL3S.3 R13.2)
LED_OK: MCU (U25.15), LEDs (PL3M.4 PL3S.4 R15.2)
LED_X2X: MCU (U25.16), LEDs (PL3M.2 PL3S.2 R9.2)
SCL: MCU (U25.25), RTC (R152.1 U30.6)
SDA: MCU (U25.26), RTC (R153.1 U30.5)